# EAGLE design ADC_v1 (EAGLE 6.1)
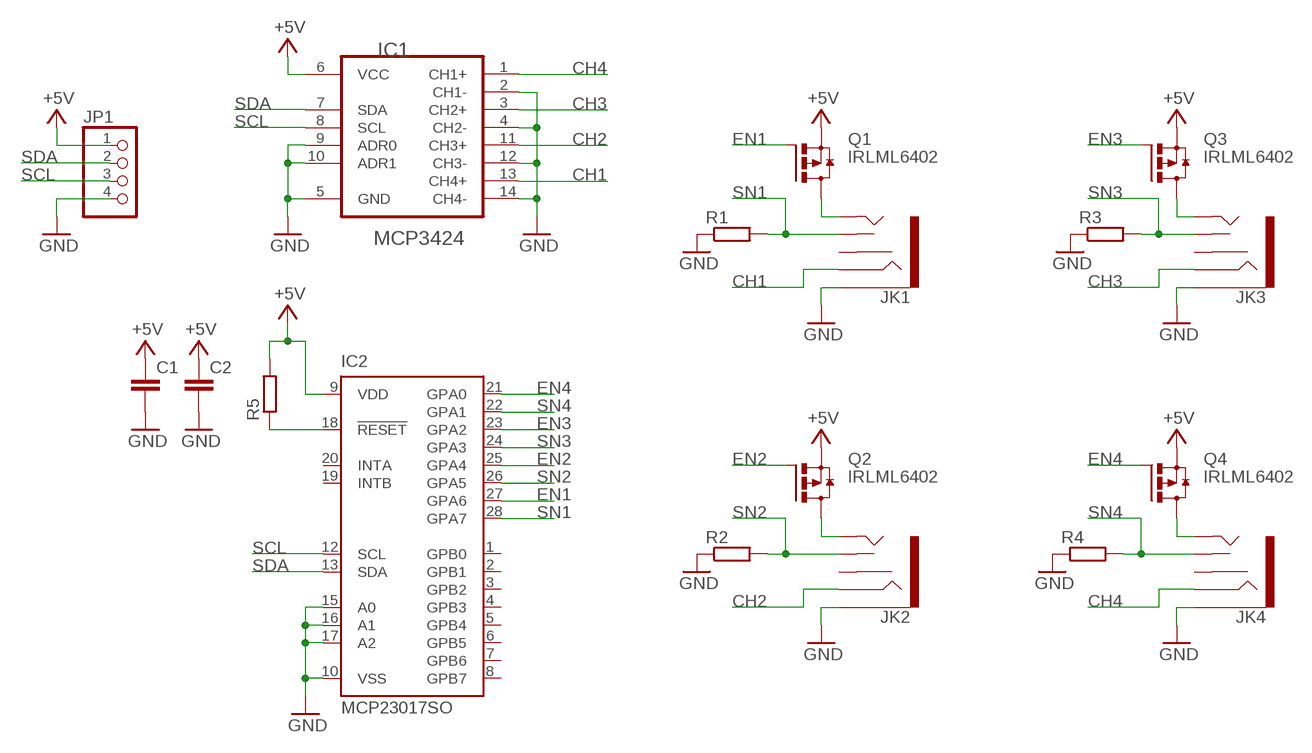
[diagram p0: schematic, sheet 1]

## Parts
C1  C-EUC0805K  [C0805K]
C2  C-EUC0805K  [C0805K]
IC1  MCP3424  [SO14]
IC2  MCP23017SO  [SO28W]
JK1  AUDIO-JACK2PTH  [AUDIO-JACK]
JK2  AUDIO-JACK2PTH  [AUDIO-JACK]
JK3  AUDIO-JACK2PTH  [AUDIO-JACK]
JK4  AUDIO-JACK2PTH  [AUDIO-JACK]
JP1  PINHD-1X4  [1X04]
Q1  IRLML6402  [SOT23]
Q2  IRLML6402  [SOT23]
Q3  IRLML6402  [SOT23]
Q4  IRLML6402  [SOT23]
R1  R-EU_R0805  [R0805]
R2  R-EU_R0805  [R0805]
R3  R-EU_R0805  [R0805]
R4  R-EU_R0805  [R0805]
R5  R-EU_R0805  [R0805]

## Nets
+5V: C1.1 C2.1 IC1.6(VCC) IC2.9(VDD) JP1.1 Q1.2(S) Q2.2(S) Q3.2(S) Q4.2(S) R5.2
CH1: IC1.13(CH4+) JK1.RING
CH2: IC1.11(CH3+) JK2.RING
CH3: IC1.3(CH2+) JK3.RING
CH4: IC1.1(CH1+) JK4.RING
EN1: IC2.27(GPA6) Q1.1(G)
EN2: IC2.25(GPA4) Q2.1(G)
EN3: IC2.23(GPA2) Q3.1(G)
EN4: IC2.21(GPA0) Q4.1(G)
GND: C1.2 C2.2 IC1.2(CH1-) IC1.4(CH2-) IC1.5(GND) IC1.9(ADR0) IC1.10(ADR1) IC1.12(CH3-) IC1.14(CH4-) IC2.10(VSS) IC2.15(A0) IC2.16(A1) IC2.17(A2) JK1.SLEEVE JK2.SLEEVE JK3.SLEEVE JK4.SLEEVE JP1.4 R1.1 R2.1 R3.1 R4.1
N$1: JK1.TIP Q1.3(D)
N$2: IC2.18(!RESET) R5.1
N$3: JK2.TIP Q2.3(D)
N$4: JK3.TIP Q3.3(D)
N$5: JK4.TIP Q4.3(D)
SCL: IC1.8(SCL) IC2.12(SCL) JP1.3
SDA: IC1.7(SDA) IC2.13(SDA) JP1.2
SN1: IC2.28(GPA7) JK1.TSH R1.2
SN2: IC2.26(GPA5) JK2.TSH R2.2
SN3: IC2.24(GPA3) JK3.TSH R3.2
SN4: IC2.22(GPA1) JK4.TSH R4.2
Unconnected: IC2.1(GPB0) IC2.2(GPB1) IC2.3(GPB2) IC2.4(GPB3) IC2.5(GPB4) IC2.6(GPB5) IC2.7(GPB6) IC2.8(GPB7) IC2.19(INTB) IC2.20(INTA) JK1.RSH JK2.RSH JK3.RSH JK4.RSH

## Library data of the parts
C1 C2 = mark_1:C-EU: CAPACITOR, European symbol
IC1 = mark_1:MCP3424: Analog-to-Digital Converter; MPN: MCP3424-E/SL; OC_FARNELL: 1630424; OC_NEWARK: 54M4871; PACKAGE: SOIC-14; SUPPLIER: Microchip
IC2 = mark_1:MCP23017: http://ww1.microchip.com/downloads/en/DeviceDoc/21952a.pdf Source: http://ww1.microchip.com/downloads/en/DeviceDoc/21952a.pdf; MF: MICROCHIP; MPN: MCP23017-E/SO; OC_FARNELL: 1332087; OC_NEWARK: 31K2958
JK1-JK4 = mark_1:AUDIO-JACK2
JP1 = mark_1:PINHD-1X4: PIN HEADER
Q1-Q4 = mark_1:IRLML6402: Single P-Channe MOSFET
R1-R5 = mark_1:R-EU_: RESISTOR, European symbol

## Board
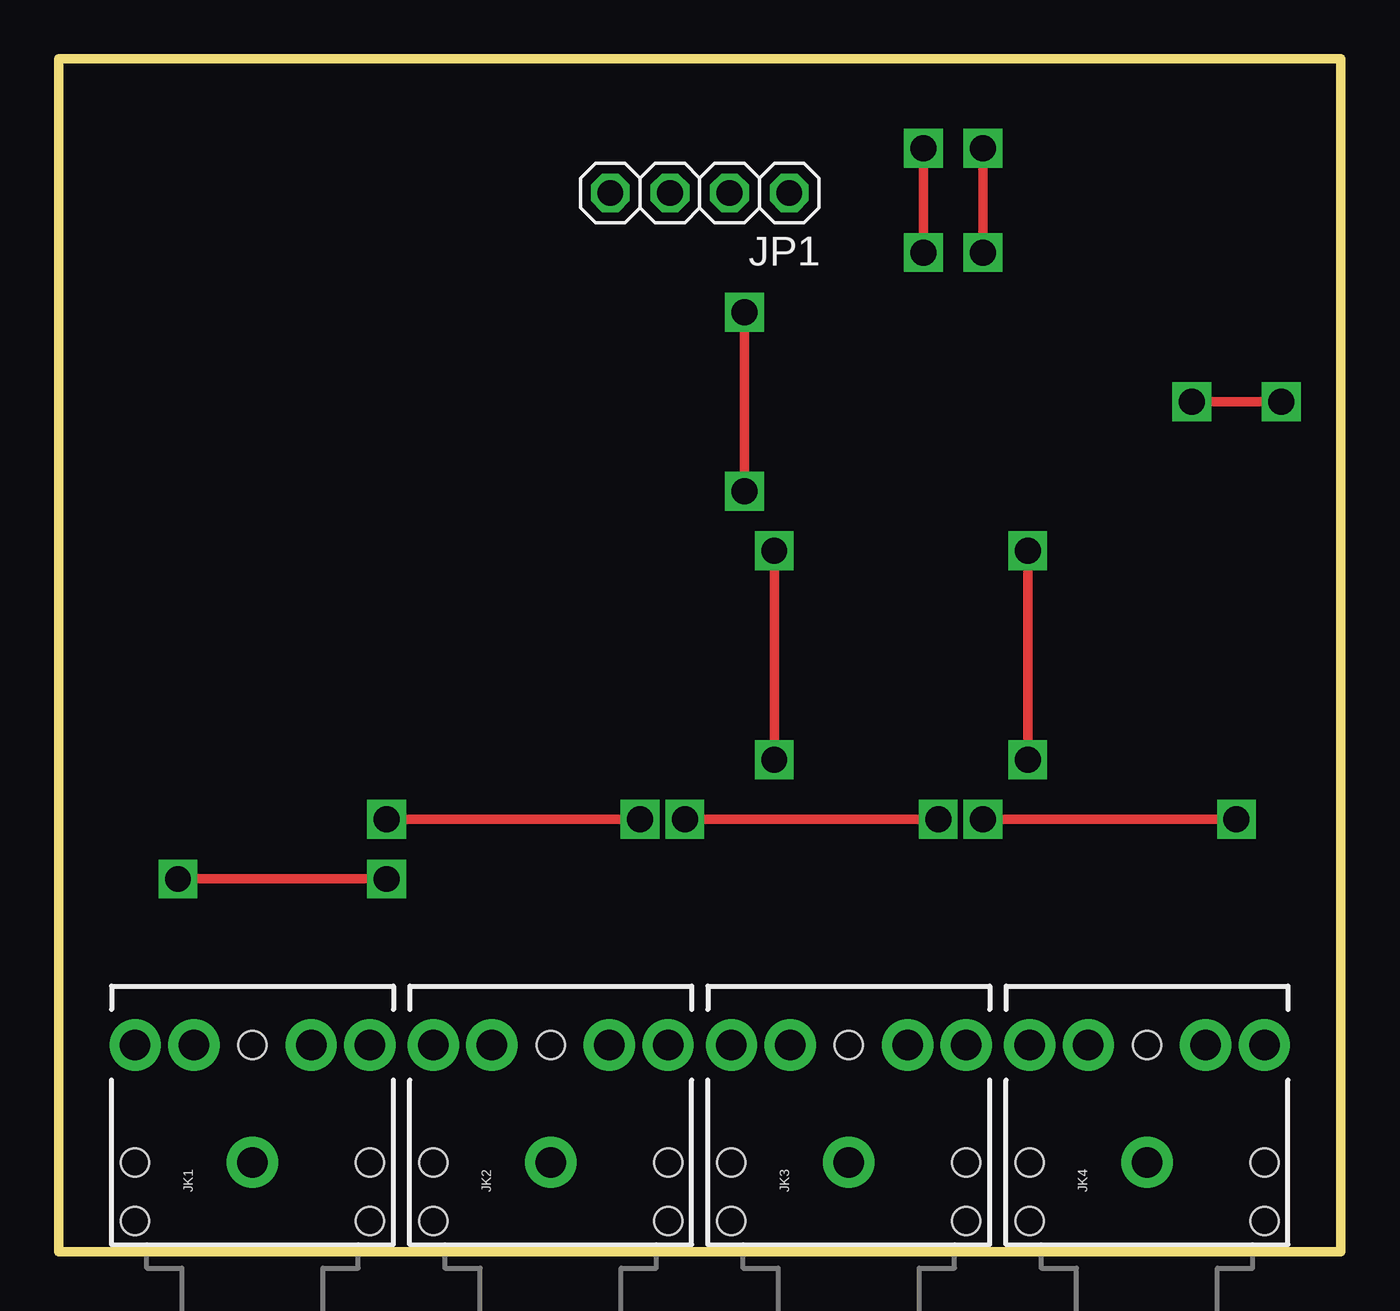
[diagram p1: board, top side]
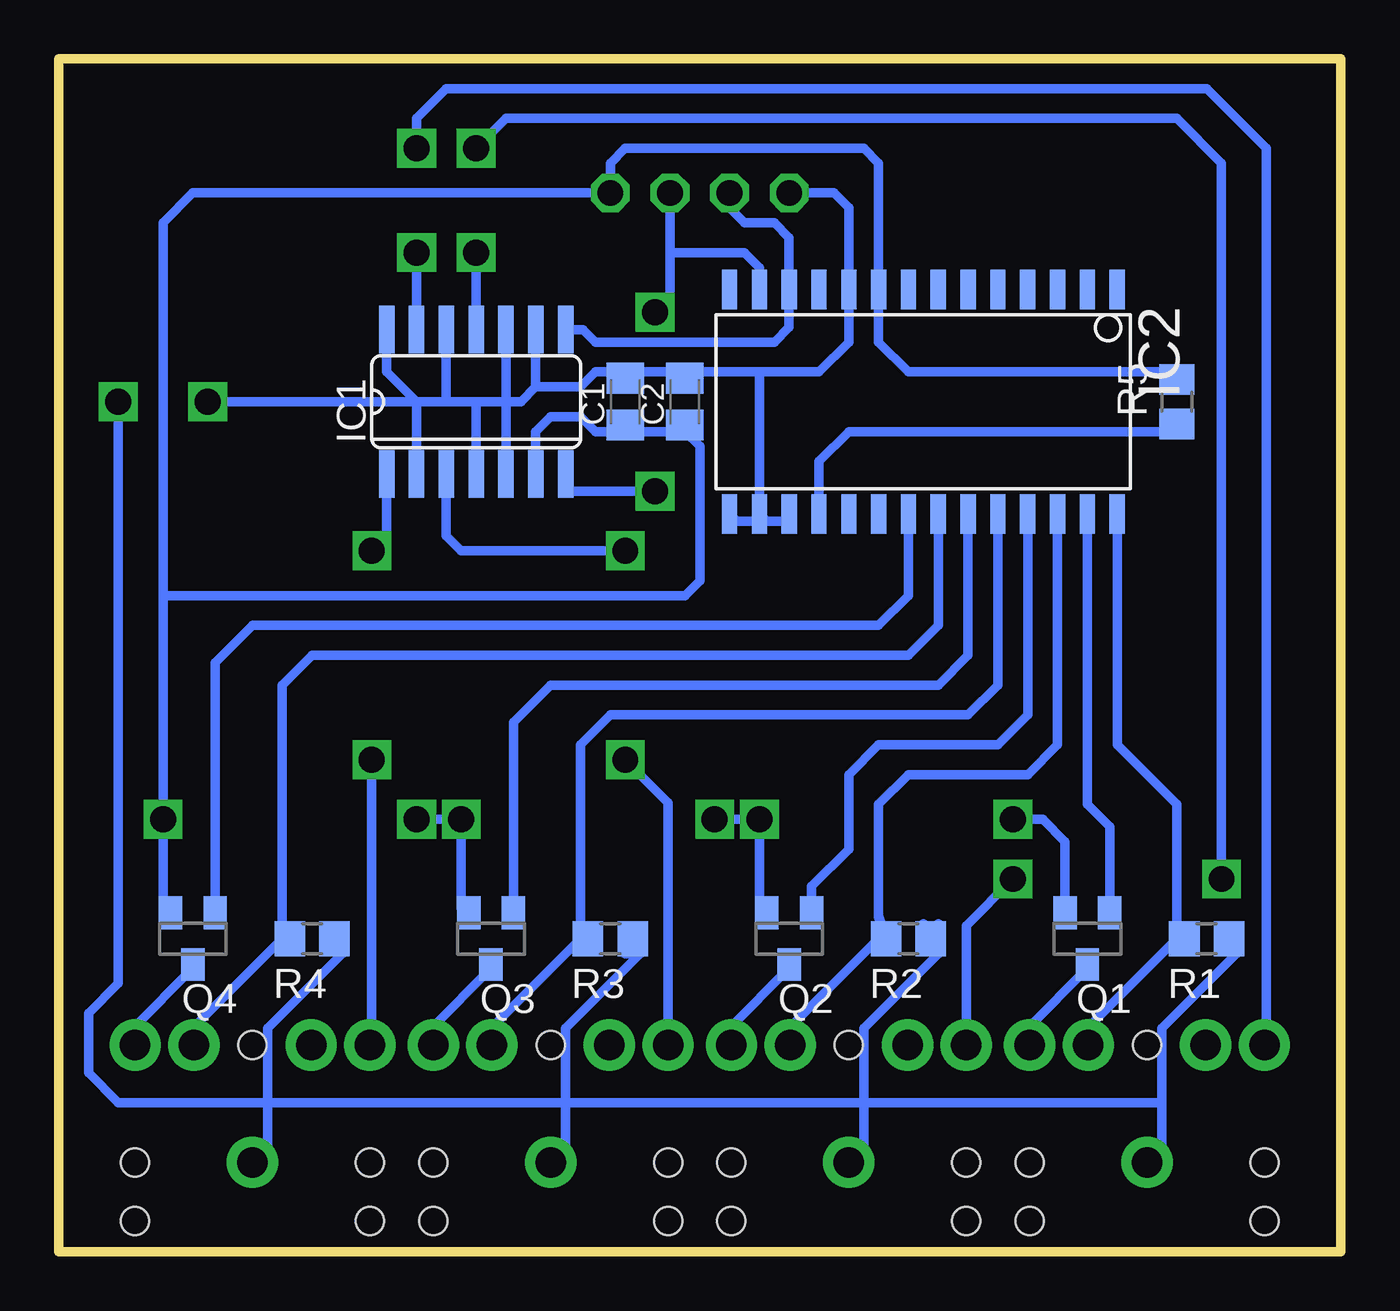
[diagram p2: board, bottom side, seen from below]

Size 54.61 x 50.8 mm. Coordinates in mm from the lower left corner, seen from the top.
Outline: 0,0 54.61,0 54.61,50.8 0,50.8 0,0
Copper layers (1*16): Top 0.035mm / dielectric 1.5mm / Bottom 0.035mm
Design rules: minimum track width 10mil, minimum drill 24mil, track to track 8mil, track to pad 8mil, pad to pad 8mil, via to via 8mil, smd to smd 8mil, copper to edge 40mil, drill to drill 8mil, minimum pad ring 10mil, minimum via ring 8mil, stop-mask expansion 4mil, vias tented up to drill 0mil, thermal gap 10mil

### Footprints (pad centres in the part's own frame; a part is rotated, then mirrored left to right if it is on the bottom)
C0805K = smd 1.3 x 1.6: 1 -1,0; 2 1,0
SO14 = smd 2.032 x 0.66: 1 -3.073,3.81; 2 -3.073,2.54; 3 -3.073,1.27; 4 -3.073,0; 5 -3.073,-1.27; 6 -3.073,-2.54; 7 -3.073,-3.81; 8 3.073,-3.81; 9 3.073,-2.54; 10 3.073,-1.27; 11 3.073,0; 12 3.073,1.27; 13 3.073,2.54; 14 3.073,3.81
SO28W = smd 0.65 x 1.7: 1 -7.62,-4.78; 2 -6.35,-4.78; 3 -5.08,-4.78; 4 -3.81,-4.78; 5 -2.54,-4.78; 6 -1.27,-4.78; 7 0,-4.78; 8 1.27,-4.78; 9 2.54,-4.78; 10 3.81,-4.78; 11 5.08,-4.78; 12 6.35,-4.78; 13 7.62,-4.78; 14 8.89,-4.78; 15 8.89,4.78; 16 7.62,4.78; 17 6.35,4.78; 18 5.08,4.78; 19 3.81,4.78; 20 2.54,4.78; 21 1.27,4.78; 22 0,4.78; 23 -1.27,4.78; 24 -2.54,4.78; 25 -3.81,4.78; 26 -5.08,4.78; 27 -6.35,4.78; 28 -7.62,4.78
AUDIO-JACK = drill 1.3 pad 2.184: RING 5,5; RSH 5,2.5; SLEEVE 0,0; TIP 5,-5; TSH 5,-2.5 | hole 1.2: 0,5; -2.5,5; -2.5,-5; 0,-5; 5,0
1X04 = drill 1.1 octagon: 1 -3.81,0; 2 -1.27,0; 3 1.27,0; 4 3.81,0
SOT23 = smd 1 x 1.4: 1 -0.95,-1.1; 2 0.95,-1.1; 3 0,1.1
R0805 = smd 1.3 x 1.5: 1 -0.95,0; 2 0.95,0

### Placement (x,y rotation side)
C1  30.48,36.2 90 bottom
C2  27.94,36.2 90 bottom
IC1  36.83,36.2 90 bottom
IC2  17.14,36.2 180 bottom
JK1  8.26,3.81 90 top
JK2  20.95,3.81 90 top
JK3  33.66,3.81 90 top
JK4  46.36,3.81 90 top
JP1  27.3,45.09 180 top
Q1  10.79,13.34 180 bottom
Q2  23.5,13.34 180 bottom
Q3  36.2,13.34 180 bottom
Q4  48.9,13.34 180 bottom
R1  5.71,13.34 180 bottom
R2  18.41,13.34 180 bottom
R3  31.11,13.34 180 bottom
R4  43.82,13.34 180 bottom
R5  6.98,36.2 90 bottom

### Tracks (layer width: path | path; a pad name or v marks a point on that pad's centre or on a via)
+5V  (via drill 1.1)
  Top 0.406: v13.97,18.41 v24.77,18.41 | v26.67,18.41 v37.47,18.41 | v39.37,18.41 v50.17,18.41
  Bottom 0.406: R5.2 7.3,37.47 18.41,37.47 19.68,38.73 IC2.9 19.68,46.35 20.32,46.99 30.48,46.99 31.11,46.35 JP1.1 48.9,45.09 50.17,43.81 50.17,27.94 | 30.75,34.92 27.94,34.92 | 30.75,34.92 31.75,34.92 32.38,35.56 33.66,35.56 34.29,34.92 IC1.6 | 30.75,34.92 C1.1 | 27.94,34.92 C2.1 | v26.67,18.41 v24.77,18.41 24.77,14.61 24.61,14.61 Q2.2 | v39.37,18.41 v37.47,18.41 37.47,14.61 37.3,14.44 Q3.2 | Q4.2 49.7,14.44 50.17,14.61 v50.17,18.41 50.17,27.94 | 50.17,27.94 27.94,27.94 27.3,28.57 27.3,34.29 27.94,34.92 | Q1.2 11.74,17.46 12.7,18.41 v13.97,18.41
CH1  (via drill 1.1)
  Top 0.406: v39.37,46.99 v39.37,42.55
  Bottom 0.406: v39.37,42.55 IC1.13 39.37,38.73 | JK1.RING 3.17,8.89 3.17,46.99 5.71,49.53 38.1,49.53 39.37,48.26 v39.37,46.99
CH2  (via drill 1.1)
  Top 0.406: v13.97,15.88 v5.08,15.88 | v36.83,46.99 v36.83,42.55
  Bottom 0.406: JK2.RING 15.96,13.89 v13.97,15.88 | v5.08,15.88 5.08,46.35 6.98,48.26 35.56,48.26 v36.83,46.99 | v36.83,42.55 IC1.11
CH3  (via drill 1.1)
  Top 0.406: v30.48,20.95 v30.48,29.84
  Bottom 0.406: JK3.RING 28.66,19.13 v30.48,20.95 | v30.48,29.84 37.47,29.84 38.1,30.48 IC1.3
CH4  (via drill 1.1)
  Top 0.406: v41.28,20.95 v41.28,29.84
  Bottom 0.406: v41.28,20.95 41.28,8.89 JK4.RING | v41.28,29.84 40.64,30.48 IC1.1
EN1
  Bottom 0.254: 9.53,14.61 Q1.1
  Bottom 0.406: Q1.1 9.84,18.1 10.79,19.05 IC2.27
EN2
  Bottom 0.406: Q2.1 22.54,15.55 20.95,17.14 20.95,20.32 19.68,21.59 14.61,21.59 13.33,22.86 IC2.25
EN3
  Bottom 0.406: Q3.1 35.25,22.54 33.66,24.13 17.14,24.13 15.88,25.4 IC2.23
EN4
  Bottom 0.406: Q4.1 47.95,25.08 46.36,26.67 19.68,26.67 18.41,27.94 IC2.21
GND  (via drill 1.1)
  Top 0.406: v48.26,36.2 v52.07,36.2
  Bottom 0.254: 27.94,37.47 C2.2 | 35.56,32.38 IC1.5 | 35.56,38.73 IC1.10
  Bottom 0.406: 4.45,13.34 4.45,12.7 7.62,9.53 7.62,6.35 | 4.45,13.34 4.45,13.65 R1.1 4.45,13.34 | 17.78,13.97 R2.1 17.14,13.97 17.14,12.7 20.32,9.53 20.32,6.35 | JK3.SLEEVE 33.02,4.45 33.02,6.35 | 29.84,13.34 R3.1 30.48,12.7 29.84,12.7 33.02,9.53 33.02,6.35 | 45.72,6.35 45.72,4.45 JK4.SLEEVE | 45.72,6.35 45.72,9.53 42.55,12.7 42.55,13.34 R4.1 | 35.56,36.2 36.83,36.2 | 36.83,36.2 38.1,36.2 | 38.1,36.2 39.37,36.2 | IC1.12 38.1,36.2 | IC1.9 34.29,36.83 | IC1.10 35.56,36.2 | IC1.5 35.56,36.2 | IC1.4 36.83,36.2 | IC1.2 39.37,36.2 | IC1.14 40.64,37.47 39.37,36.2 | 35.56,36.2 34.93,36.2 34.29,36.83 | IC2.16 24.46,31.11 23.5,31.11 IC2.17 | IC2.16 24.77,31.11 25.73,31.11 | 25.73,31.11 IC2.15 26.04,31.11 25.73,31.11 | 24.77,37.47 27.3,37.47 | 27.3,37.47 27.57,37.2 C2.2 | 24.77,37.47 22.22,37.47 20.95,38.73 IC2.10 20.95,44.45 21.59,45.09 JP1.4 | 7.62,6.35 20.32,6.35 | 20.32,6.35 33.02,6.35 | 33.02,6.35 45.72,6.35 | 7.62,6.35 7.62,4.45 JK1.SLEEVE | 20.32,6.35 20.32,4.45 JK2.SLEEVE | 30.48,37.47 27.94,37.47 27.3,37.47 | 30.48,37.47 31.75,37.47 32.38,36.83 34.29,36.83 | C1.2 30.48,37.47 | IC2.16 24.77,37.47 | 39.37,36.2 v48.26,36.2 | v52.07,36.2 52.07,11.43 53.34,10.16 53.34,7.62 52.07,6.35 45.72,6.35
N$1
  Bottom 0.406: Q1.3 10.79,12.06 13.33,9.53 13.33,8.89 JK1.TIP
N$2
  Bottom 0.406: R5.1 7.3,34.92 20.95,34.92 22.22,33.66 IC2.18 22.22,31.11
N$3
  Bottom 0.406: Q2.3 23.5,12.06 26.04,9.53 26.04,8.89 JK2.TIP
N$4
  Bottom 0.406: Q3.3 36.2,12.06 38.74,9.53 38.74,8.89 JK3.TIP
N$5
  Bottom 0.406: Q4.3 48.9,12.06 51.44,9.53 51.44,8.89 JK4.TIP
SCL
  Bottom 0.406: JP1.3 26.04,44.45 25.4,43.81 24.13,43.81 23.5,43.18 IC2.12 23.5,39.37 24.13,38.73 31.75,38.73 32.28,39.27 IC1.8
SDA  (via drill 1.1)
  Top 0.406: v29.21,32.38 v29.21,40.01
  Bottom 0.406: IC2.13 24.77,41.91 25.4,42.55 28.57,42.55 | 28.57,42.55 JP1.2 | IC1.7 33.02,32.38 v29.21,32.38 | v29.21,40.01 28.57,40.64 28.57,42.55
SN1
  Bottom 0.406: JK1.TSH 10.75,9.56 6.98,13.34 6.98,13.97 | R1.2 6.98,13.97 | 6.98,13.97 6.98,19.05 9.53,21.59 IC2.28
SN2
  Bottom 0.406: JK2.TSH 23.45,9.56 19.68,13.34 19.68,13.97 R2.2 19.68,14.29 19.68,19.05 18.41,20.32 13.33,20.32 12.06,21.59 IC2.26
SN3
  Bottom 0.406: JK3.TSH 36.16,9.56 32.38,13.34 R3.2 32.38,13.97 32.38,21.59 31.11,22.86 15.88,22.86 14.61,24.13 IC2.24
SN4
  Bottom 0.406: JK4.TSH 48.86,9.56 45.09,13.34 45.09,13.97 | R4.2 45.09,13.97 | 45.09,13.97 45.09,24.13 43.82,25.4 18.41,25.4 17.14,26.67 IC2.22